# Altium project PYRAMIDE CONTROLLER VER01 REVA.PrjPcb (part 2 of 2)

## Sheet Connectors.SchDoc: Connectors
size A3; Date: 17.10.2015; DocumentNumber: 5; Revision: 11; SheetNumber: 5; SheetTotal: 5
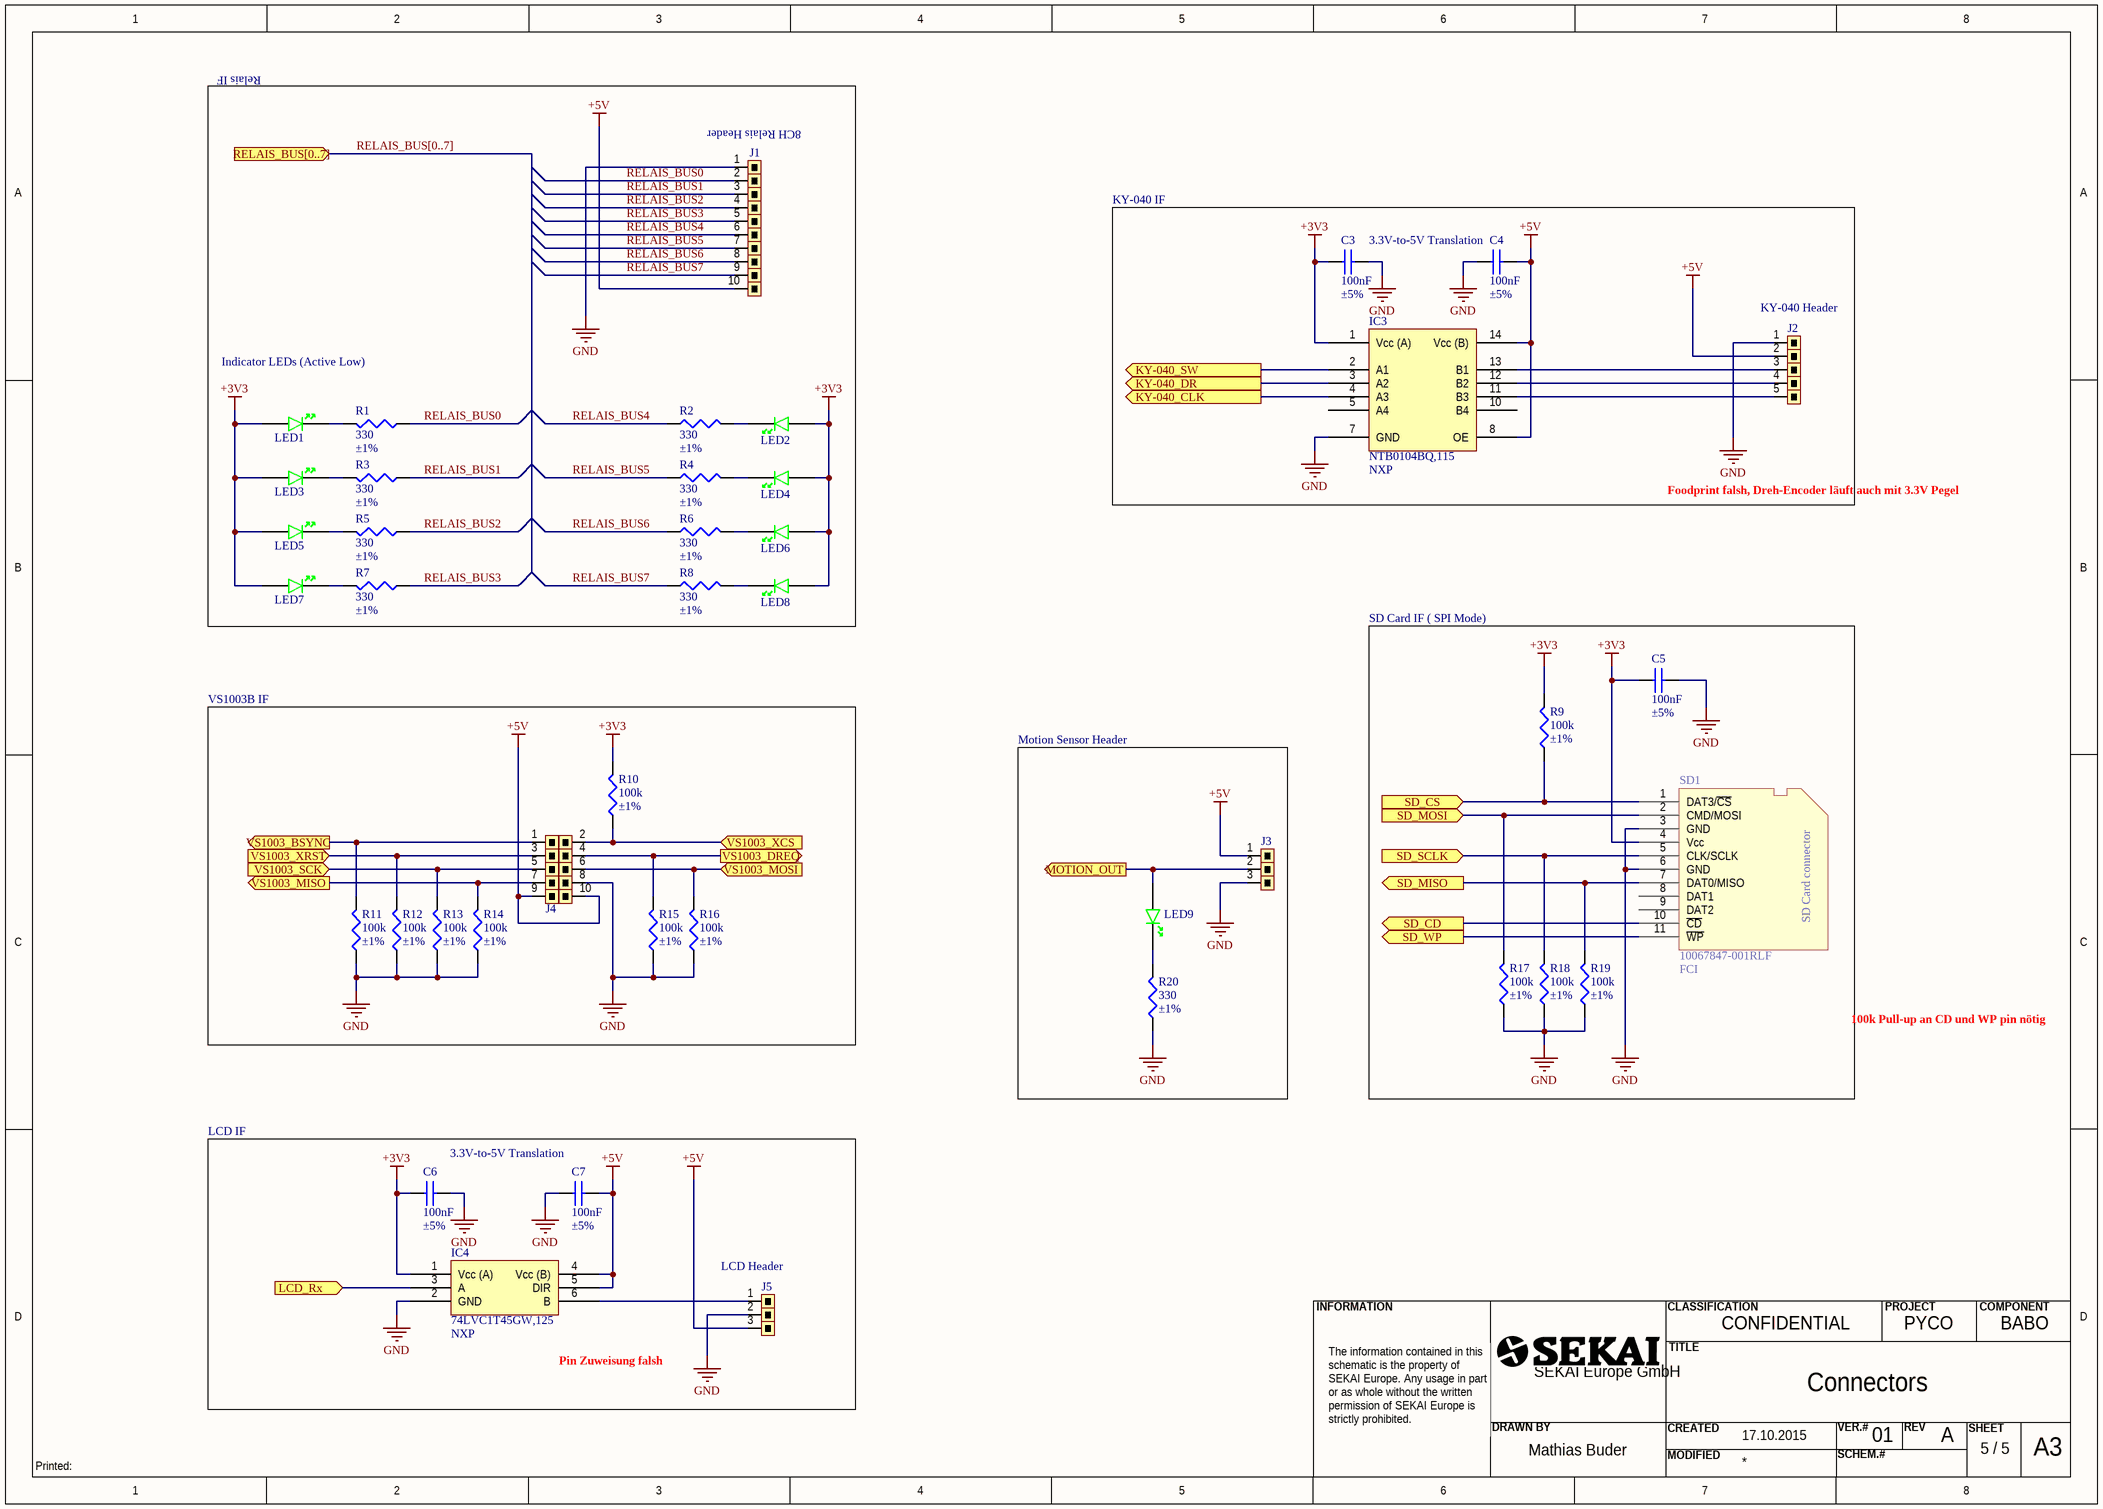
[diagram p3: Connectors.SchDoc]

### Parts
C3  Kapazität: 100nF  Toleranz: ±5%  [C0603]  (hidden comment: C0603C104J4RACTU)
C4  Kapazität: 100nF  Toleranz: ±5%  [C0603]  (hidden comment: C0603C104J4RACTU)
C5  Kapazität: 100nF  Toleranz: ±5%  [C0603]  (hidden comment: C0603C104J4RACTU)
C6  Kapazität: 100nF  Toleranz: ±5%  [C0603]  (hidden comment: C0603C104J4RACTU)
C7  Kapazität: 100nF  Toleranz: ±5%  [C0603]  (hidden comment: C0603C104J4RACTU)
IC3  NTB0104BQ,115  Manufacturer: NXP  [QFN14]
IC4  74LVC1T45GW,125  Manufacturer: NXP  [SOT363]
J1  Header 1x10  [Post Height Terminal Strip 1x10]  (value not drawn)
J2  Header 1x5  [Post Height Terminal Strip 1x5]  (value not drawn)
J3  1x3  [Post Height Terminal Strip 1x3]  (value not drawn)
J4  Header 2x5  [Post Height Terminal Strip 2x5]  (value not drawn)
J5  1x3  [Post Height Terminal Strip 1x3]  (value not drawn)
LED1  LTST-C193KGKT-5A  [LED0603-GREEN]  (value not drawn)
LED2  LTST-C193KGKT-5A  [LED0603-GREEN]  (value not drawn)
LED3  LTST-C193KGKT-5A  [LED0603-GREEN]  (value not drawn)
LED4  LTST-C193KGKT-5A  [LED0603-GREEN]  (value not drawn)
LED5  LTST-C193KGKT-5A  [LED0603-GREEN]  (value not drawn)
LED6  LTST-C193KGKT-5A  [LED0603-GREEN]  (value not drawn)
LED7  LTST-C193KGKT-5A  [LED0603-GREEN]  (value not drawn)
LED8  LTST-C193KGKT-5A  [LED0603-GREEN]  (value not drawn)
LED9  LTST-C193KGKT-5A  [LED0603-GREEN]  (value not drawn)
R1  Resistance (Ohms): 330  Tolerance: ±1%  [R0603]  (hidden comment: ERJ-3EKF3300V)
R2  Resistance (Ohms): 330  Tolerance: ±1%  [R0603]  (hidden comment: ERJ-3EKF3300V)
R3  Resistance (Ohms): 330  Tolerance: ±1%  [R0603]  (hidden comment: ERJ-3EKF3300V)
R4  Resistance (Ohms): 330  Tolerance: ±1%  [R0603]  (hidden comment: ERJ-3EKF3300V)
R5  Resistance (Ohms): 330  Tolerance: ±1%  [R0603]  (hidden comment: ERJ-3EKF3300V)
R6  Resistance (Ohms): 330  Tolerance: ±1%  [R0603]  (hidden comment: ERJ-3EKF3300V)
R7  Resistance (Ohms): 330  Tolerance: ±1%  [R0603]  (hidden comment: ERJ-3EKF3300V)
R8  Resistance (Ohms): 330  Tolerance: ±1%  [R0603]  (hidden comment: ERJ-3EKF3300V)
R9  Resistance (Ohms): 100k  Tolerance: ±1%  [R0603]  (hidden comment: ERJ-3EKF1003V)
R10  Resistance (Ohms): 100k  Tolerance: ±1%  [R0603]  (hidden comment: ERJ-3EKF1003V)
R11  Resistance (Ohms): 100k  Tolerance: ±1%  [R0603]  (hidden comment: ERJ-3EKF1003V)
R12  Resistance (Ohms): 100k  Tolerance: ±1%  [R0603]  (hidden comment: ERJ-3EKF1003V)
R13  Resistance (Ohms): 100k  Tolerance: ±1%  [R0603]  (hidden comment: ERJ-3EKF1003V)
R14  Resistance (Ohms): 100k  Tolerance: ±1%  [R0603]  (hidden comment: ERJ-3EKF1003V)
R15  Resistance (Ohms): 100k  Tolerance: ±1%  [R0603]  (hidden comment: ERJ-3EKF1003V)
R16  Resistance (Ohms): 100k  Tolerance: ±1%  [R0603]  (hidden comment: ERJ-3EKF1003V)
R17  Resistance (Ohms): 100k  Tolerance: ±1%  [R0603]  (hidden comment: ERJ-3EKF1003V)
R18  Resistance (Ohms): 100k  Tolerance: ±1%  [R0603]  (hidden comment: ERJ-3EKF1003V)
R19  Resistance (Ohms): 100k  Tolerance: ±1%  [R0603]  (hidden comment: ERJ-3EKF1003V)
R20  Resistance (Ohms): 330  Tolerance: ±1%  [R0603]  (hidden comment: ERJ-3EKF3300V)
SD1  10067847-001RLF  Manufacturer: FCI  [10067847-001RLF]

### Blocks framed on the sheet
VS1003B IF: J4 R10-R16
Motion Sensor Header: J3 LED9 R20

### Ports
KY-040_CLK (out), KY-040_DR (out), KY-040_SW (out), LCD_Rx (in), MOTION_OUT (out), RELAIS_BUS[0..7] (in), SD_CD (out), SD_CS (in), SD_MISO (out), SD_MOSI (in), SD_SCLK (in), SD_WP (out), VS1003_BSYNC (out), VS1003_DREQ (out), VS1003_MISO (out), VS1003_MOSI (in), VS1003_SCK (in), VS1003_XCS (in), VS1003_XRST (in)

### Nets
+3V3: C3.1 C5.1 C6.1 IC3.1(Vcc_(A)) IC4.1(Vcc_(A)) LED1.1(ANODE) LED2.1(ANODE) LED3.1(ANODE) LED4.1(ANODE) LED5.1(ANODE) LED6.1(ANODE) LED7.1(ANODE) LED8.1(ANODE) R9.2 R10.2 SD1.4(Vcc)
+5V: C4.2 C7.2 IC3.8(OE) IC3.14(Vcc_(B)) IC4.4(Vcc_(B)) IC4.5(DIR) J1.10 J2.2 J3.1 J4.9 J4.10 J5.3
GND: C3.2 C4.1 C5.2 C6.2 C7.1 IC3.7(GND) IC4.2(GND) J1.1 J2.1 J3.3 J4.8 J5.2 R11.1 R12.1 R13.1 R14.1 R15.1 R16.1 R17.1 R18.1 R19.1 R20.1 SD1.3(GND) SD1.6(GND)
RELAIS_BUS0: J1.2 R1.1
RELAIS_BUS1: J1.3 R3.1
RELAIS_BUS2: J1.4 R5.1
RELAIS_BUS3: J1.5 R7.1
RELAIS_BUS4: J1.6 R2.1
RELAIS_BUS5: J1.7 R4.1
RELAIS_BUS6: J1.8 R6.1
RELAIS_BUS7: J1.9 R8.1
NetIC3_2: IC3.2(A1) ; port KY-040_SW
NetIC3_3: IC3.3(A2) ; port KY-040_DR
NetIC3_4: IC3.4(A3) ; port KY-040_CLK
NetIC3_11: IC3.11(B3) J2.5
NetIC3_12: IC3.12(B2) J2.4
NetIC3_13: IC3.13(B1) J2.3
NetIC4_3: IC4.3(A) ; port LCD_Rx
NetIC4_6: IC4.6(B) J5.1
NetJ3_2: J3.2 LED9.1(ANODE) ; port MOTION_OUT
NetJ4_1: J4.1 R11.2 ; port VS1003_BSYNC
NetJ4_2: J4.2 R10.1 ; port VS1003_XCS
NetJ4_3: J4.3 R12.2 ; port VS1003_XRST
NetJ4_4: J4.4 R15.2 ; port VS1003_DREQ
NetJ4_5: J4.5 R13.2 ; port VS1003_SCK
NetJ4_6: J4.6 R16.2 ; port VS1003_MOSI
NetJ4_7: J4.7 R14.2 ; port VS1003_MISO
NetJ6_1.08: R17.2 SD1.2(CMD/MOSI) ; port SD_MOSI
NetJ6_2.08: R19.2 SD1.7(DAT0/MISO) ; port SD_MISO
NetJ6_2.09: R9.1 SD1.1(DAT3/~{CS}) ; port SD_CS
NetJ6_2.10: R18.2 SD1.5(CLK/SCLK) ; port SD_SCLK
NetJ6_3.05: SD1.10(~{CD}) ; port SD_CD
NetJ6_3.06: SD1.11(~{WP}) ; port SD_WP
NetLED1_2: LED1.2(CATHODE) R1.2
NetLED2_2: LED2.2(CATHODE) R2.2
NetLED3_2: LED3.2(CATHODE) R3.2
NetLED4_2: LED4.2(CATHODE) R4.2
NetLED5_2: LED5.2(CATHODE) R5.2
NetLED6_2: LED6.2(CATHODE) R6.2
NetLED7_2: LED7.2(CATHODE) R7.2
NetLED8_2: LED8.2(CATHODE) R8.2
NetLED9_2: LED9.2(CATHODE) R20.2

Not connected (* = marked no-connect by the designer): IC3 5(A4) 10(B4); SD1 8(DAT1) 9(DAT2)

### Buses and harness runs
bus RELAIS_BUS[0..7] = port RELAIS_BUS[0..7]

### Notes on the sheet
- Relais IF
- (near J1) 8CH Relais Header
- KY-040 IF
- 3.3V-to-5V Translation
- (near J2) KY-040 Header
- Indicator LEDs (Active Low)
- (near IC3) Foodprint falsh, Dreh-Encoder läuft auch mit 3.3V Pegel
- SD Card IF ( SPI Mode)
- 100k Pull-up an CD und WP pin nötig
- LCD IF
- (near J5) LCD Header
- Pin Zuweisung falsh
- INFORMATION
- CLASSIFICATION
- PROJECT
- COMPONENT
- SEKAI Europe GmbH
- TITLE
- The information contained in this schematic is the property of SEKAI Europe. Any usage in part or as whole without the written permission of SEKAI Europe is strictly prohibited.
- DRAWN BY
- CREATED
- MODIFIED
- VER.#
- SCHEM.#
- REV
- SHEET
- A3
- Printed:
- (in symbol 10067847-001RLF) SD Card connector

### Library data of the parts
C3-C7 = C0603C104J4RACTU: CAP CER 100NF 16V 5% X7R 0603; Manufacturer: Kemet; Verpackung: Am Band (Cut Tape - CT); Montagetyp: Oberflächenmontage, MLCC; Betriebstemperatur: -55°C bis 125°C; Anwendungen: Mehrzweckanwendungen; Gehäuse / Hülle: 0603 (1608 Metrisch); Dicke (max.): 0,034" (0,87 mm); Supplier 1: Digi-Key; Manufacturer Part Number: C0603C104J4RACTU; RoHS: RoHS Compliant; Category: Kondensatoren; Stock 1: 557573; Pricing 1: 1=0.11, 10=0.079, 25=0.0584, 50=0.045, 100=0.0372, 250=0.03132, 1000=0.02112 (EUR); Spannung - Nennwert: 16V; Temperaturwirkungsgrad: X7R; Nenngrößen: -; Grösse / Dimension: L x B: 0,063" x 0,031" (1,60 mm x 0,80 mm); Höhe - eingesteckt (max.): -; Rastermaß: -; Funktionen: -; Leitungstyp: -; ComponentLink1URL: http://www.kemet.com/docfinder?Partnumber=C0603C104J4RACTU; ComponentLink1Description: http://www.kemet.com/docfinder?Partnumber=C0603C104J4RACTU; Supplier Part Number 1: 399-1097-1-ND
IC3 = NTB0104BQ,115: TXRX TRANSLATING 3STATE 14DHVQFN; Logic Function: Translator, Bidirectional, 3-State; Input Type: Voltage; Data Rate: 100Mbps; Number of Channels: 1; Number of Outputs/Channel: 4; Differential - Input:Output: No/No; Propagation Delay (Max): 5.9ns; Voltage - Supply: 1.2 V ~ 3.6 V, 1.65 V ~ 5.5 V; Supplier 1: Digi-Key; Manufacturer Part Number: NTB0104BQ,115; RoHS: RoHS Compliant; Category: Integrated Circuits (ICs); Stock 1: 11856; Pricing 1: 1=0.82, 10=0.732, 100=0.5708, 500=0.47204, 1000=0.3733 (EUR); Packaging: Cut Tape (CT); Output Type: Voltage; Operating Temperature: -40°C ~ 125°C; Package / Case: 14-VFQFN Exposed Pad; Supplier Device Package: 14-DHVQFN (2.5x3); Mounting Type: Surface Mount; ComponentLink1URL: http://www.nxp.com/documents/data_sheet/NTB0104.pdf; ComponentLink1Description: http://www.nxp.com/documents/data_sheet/NTB0104.pdf; Supplier Part Number 1: 568-8404-1-ND
IC4 = 74LVC1T45GW,125: TXRX XLATING DUAL 3ST 6TSSOP; Logic Function: Translator, Bidirectional, 3-State; Input Type: Voltage; Data Rate: 420Mbps; Number of Channels: 1; Differential - Input:Output: No/No; Propagation Delay (Max): 5.1ns; Voltage - Supply: 1.2 V ~ 5.5 V; Supplier 1: Digi-Key; Manufacturer Part Number: 74LVC1T45GW,125; RoHS: RoHS Compliant; Category: Integrated Circuits (ICs); Stock 1: 44867; Pricing 1: 1=0.4, 10=0.345, 100=0.2578, 500=0.20248, 1000=0.1561 (EUR); Packaging: Cut Tape (CT); Output Type: Voltage; Number of Outputs/Channel: 1; Operating Temperature: -40°C ~ 125°C; Package / Case: 6-TSSOP, SC-88, SOT-363; Supplier Device Package: 6-TSSOP; Mounting Type: Surface Mount; ComponentLink1URL: http://www.nxp.com/documents/data_sheet/74LVC_LVCH1T45.pdf; ComponentLink1Description: http://www.nxp.com/documents/data_sheet/74LVC_LVCH1T45.pdf; Supplier Part Number 1: 568-5461-1-ND
J3 J5 = Header 1x3
LED1-LED9 = LTST-C193KGKT-5A: LED GREEN CLEAR 0603 SMD; Manufacturer: Lite-On Inc.; Wavelength - Dominant: 572nm; Wavelength - Peak: 574nm; Millicandela Rating: 16.25mcd; Voltage - Forward (Vf) (Typ): 2V; Current - Test: 5mA; Viewing Angle: 130°; Lens Color: Colorless; Lens Style/Size: Rectangle with Flat Top, 1.15mm x 0.80mm; Supplier 1: Digi-Key; Manufacturer Part Number: LTST-C193KGKT-5A; RoHS: RoHS Compliant; Category: Optoelectronics; Stock 1: 64103; Pricing 1: 1=0.38, 10=0.276, 100=0.1461, 250=0.10336, 500=0.0882, 1000=0.0689 (EUR); Packaging: Digi-Reel®; Color: Green; Lens Transparency: Clear; Package / Case: 0603 (1608 Metric); Supplier Device Package: *; Size / Dimension: 1.60mm L x 0.80mm W; Height (Max): 0.35mm; Mounting Type: Surface Mount; ComponentLink1URL: http://optoelectronics.liteon.com/upload/download/DS22-2007-0094/S_110_LTST-C193KGKT-5A.pdf; ComponentLink1Description: http://optoelectronics.liteon.com/upload/download/DS22-2007-0094/S_110_LTST-C193KGKT-5A.pdf; Supplier Part Number 1: 160-1828-6-ND
R1-R8 R20 = ERJ-3EKF3300V: RES SMD 330 OHM 1% 1/10W 0603; Manufacturer: Panasonic Electronic Components; Power (Watts): 0.1W, 1/10W; Temperature Coefficient: ±100ppm/°C; Supplier 1: Digi-Key; Manufacturer Part Number: ERJ-3EKF3300V; RoHS: RoHS Compliant; Category: Resistors; Stock 1: 360334; Pricing 1: 1=0.1, 50=0.0154, 100=0.0117, 250=0.00864, 500=0.00638, 1000=0.00426, 2500=0.0036 (EUR); Packaging: Cut Tape (CT); Composition: Thick Film; Features: Automotive AEC-Q200; Operating Temperature: -55°C ~ 155°C; Package / Case: 0603 (1608 Metric); Supplier Device Package: 0603; Size / Dimension: 0.063" L x 0.031" W (1.60mm x 0.80mm); Height: 0.022" (0.55mm); Number of Terminations: 2; ComponentLink1URL: http://industrial.panasonic.com/www-cgi/jvcr13pz.cgi?E+PZ+3+AOA0002+ERJ3EKF3300V+7+WW; ComponentLink1Description: http://industrial.panasonic.com/www-cgi/jvcr13pz.cgi?E+PZ+3+AOA0002+ERJ3EKF3300V+7+WW; Supplier Part Number 1: P330HCT-ND
R9-R19 = ERJ-3EKF1003V: RES SMD 100K OHM 1% 1/10W 0603; Manufacturer: Panasonic Electronic Components; Power (Watts): 0.1W, 1/10W; Temperature Coefficient: ±100ppm/°C; Supplier 1: Digi-Key; Manufacturer Part Number: ERJ-3EKF1003V; RoHS: RoHS Compliant; Category: Resistors; Stock 1: 3830225; Pricing 1: 1=0.1, 50=0.0154, 100=0.0117, 250=0.00864, 500=0.00638, 1000=0.00426, 2500=0.0036 (EUR); Packaging: Cut Tape (CT); Composition: Thick Film; Features: Automotive AEC-Q200; Operating Temperature: -55°C ~ 155°C; Package / Case: 0603 (1608 Metric); Supplier Device Package: 0603; Size / Dimension: 0.063" L x 0.031" W (1.60mm x 0.80mm); Height: 0.022" (0.55mm); Number of Terminations: 2; ComponentLink1URL: http://industrial.panasonic.com/www-cgi/jvcr13pz.cgi?E+PZ+3+AOA0002+ERJ3EKF1003V+7+WW; ComponentLink1Description: http://industrial.panasonic.com/www-cgi/jvcr13pz.cgi?E+PZ+3+AOA0002+ERJ3EKF1003V+7+WW; Supplier Part Number 1: P100KHCT-ND
SD1 = 10067847-001RLF: CONN SD CARD PUSH-PUSH SMD; Card Type: Secure Digital - SD; Number of Positions: 12 (9 + 3); Connector Type: Connector and Ejector; Insertion, Removal Method: Push In, Push Out; Supplier 1: Digi-Key; Manufacturer Part Number: 10067847-001RLF; RoHS: RoHS Compliant; Category: Connectors, Interconnects; Stock 1: 11102; Pricing 1: 1=2.52, 10=2.419, 25=2.218, 50=2.1168, 100=2.0162 (EUR); Packaging: Cut Tape (CT); Ejector Side: -; Mounting Type: Surface Mount; Features: Board Guide, Switch; Height Above Board: 0.110" (2.80mm); Mounting Feature: Normal, Standard - Top; Contact Finish: Gold; Contact Finish Thickness: 50µin (1.27µm); ComponentLink1URL: http://portal.fciconnect.com/Comergent//fci/drawing/10067847.pdf; ComponentLink1Description: http://portal.fciconnect.com/Comergent//fci/drawing/10067847.pdf; Supplier Part Number 1: 609-3956-1-ND

## Nets that join several sheets
+3V3: Controller (J6.1.01 R21.2 R22.2), Power Supply (JP2.2 R26.2), RTC-EEPROM (C1.1 C2.2 IC1.8 IC2.2), Connectors (16 pins)
+5V: Controller (J6.3.01), Power Supply (JP3.2 R30.2), Connectors (12 pins)
GND: Controller (5 pins), Power Supply (21 pins), RTC-EEPROM (8 pins), Connectors (24 pins)
NetIC1_5: Controller (J6.1.10 R22.1), RTC-EEPROM (IC1.5 IC2.6)
NetIC1_6: Controller (J6.1.09 R21.1), RTC-EEPROM (IC1.6 IC2.5)
NetIC1_7: Controller (J6.1.05), RTC-EEPROM (IC1.7)
NetIC2_3: Controller (J6.1.06), RTC-EEPROM (IC2.3)
NetIC3_2: Controller (J6.3.07), Connectors (IC3.2)
NetIC3_3: Controller (J6.3.08), Connectors (IC3.3)
NetIC3_4: Controller (J6.3.09), Connectors (IC3.4)
NetIC4_3: Controller (J6.4.09), Connectors (IC4.3)
NetJ3_2: Controller (J6.3.04), Connectors (J3.2 LED9.1)
NetJ4_1: Controller (J6.4.05), Connectors (J4.1 R11.2)
NetJ4_2: Controller (J6.4.07), Connectors (J4.2 R10.1)
NetJ4_3: Controller (J6.4.04), Connectors (J4.3 R12.2)
NetJ4_4: Controller (J6.4.06), Connectors (J4.4 R15.2)
NetJ4_5: Controller (J6.4.01), Connectors (J4.5 R13.2)
NetJ4_6: Controller (J6.3.10), Connectors (J4.6 R16.2)
NetJ4_7: Controller (J6.2.04), Connectors (J4.7 R14.2)
NetJ6_1.08: Controller (J6.1.08), Connectors (R17.2 SD1.2)
NetJ6_2.08: Controller (J6.2.08), Connectors (R19.2 SD1.7)
NetJ6_2.09: Controller (J6.2.09), Connectors (R9.1 SD1.1)
NetJ6_2.10: Controller (J6.2.10), Connectors (R18.2 SD1.5)
NetJ6_3.05: Controller (J6.3.05), Connectors (SD1.10)
NetJ6_3.06: Controller (J6.3.06), Connectors (SD1.11)
RELAIS_BUS0: Controller (J6.1.03), Connectors (J1.2 R1.1)
RELAIS_BUS1: Controller (J6.1.04), Connectors (J1.3 R3.1)
RELAIS_BUS2: Controller (J6.2.02), Connectors (J1.4 R5.1)
RELAIS_BUS3: Controller (J6.4.03), Connectors (J1.5 R7.1)
RELAIS_BUS4: Controller (J6.1.07), Connectors (J1.6 R2.1)
RELAIS_BUS5: Controller (J6.1.02), Connectors (J1.7 R4.1)
RELAIS_BUS6: Controller (J6.3.03), Connectors (J1.8 R6.1)
RELAIS_BUS7: Controller (J6.2.06), Connectors (J1.9 R8.1)